# Altium project PA_PCB.PrjPcb
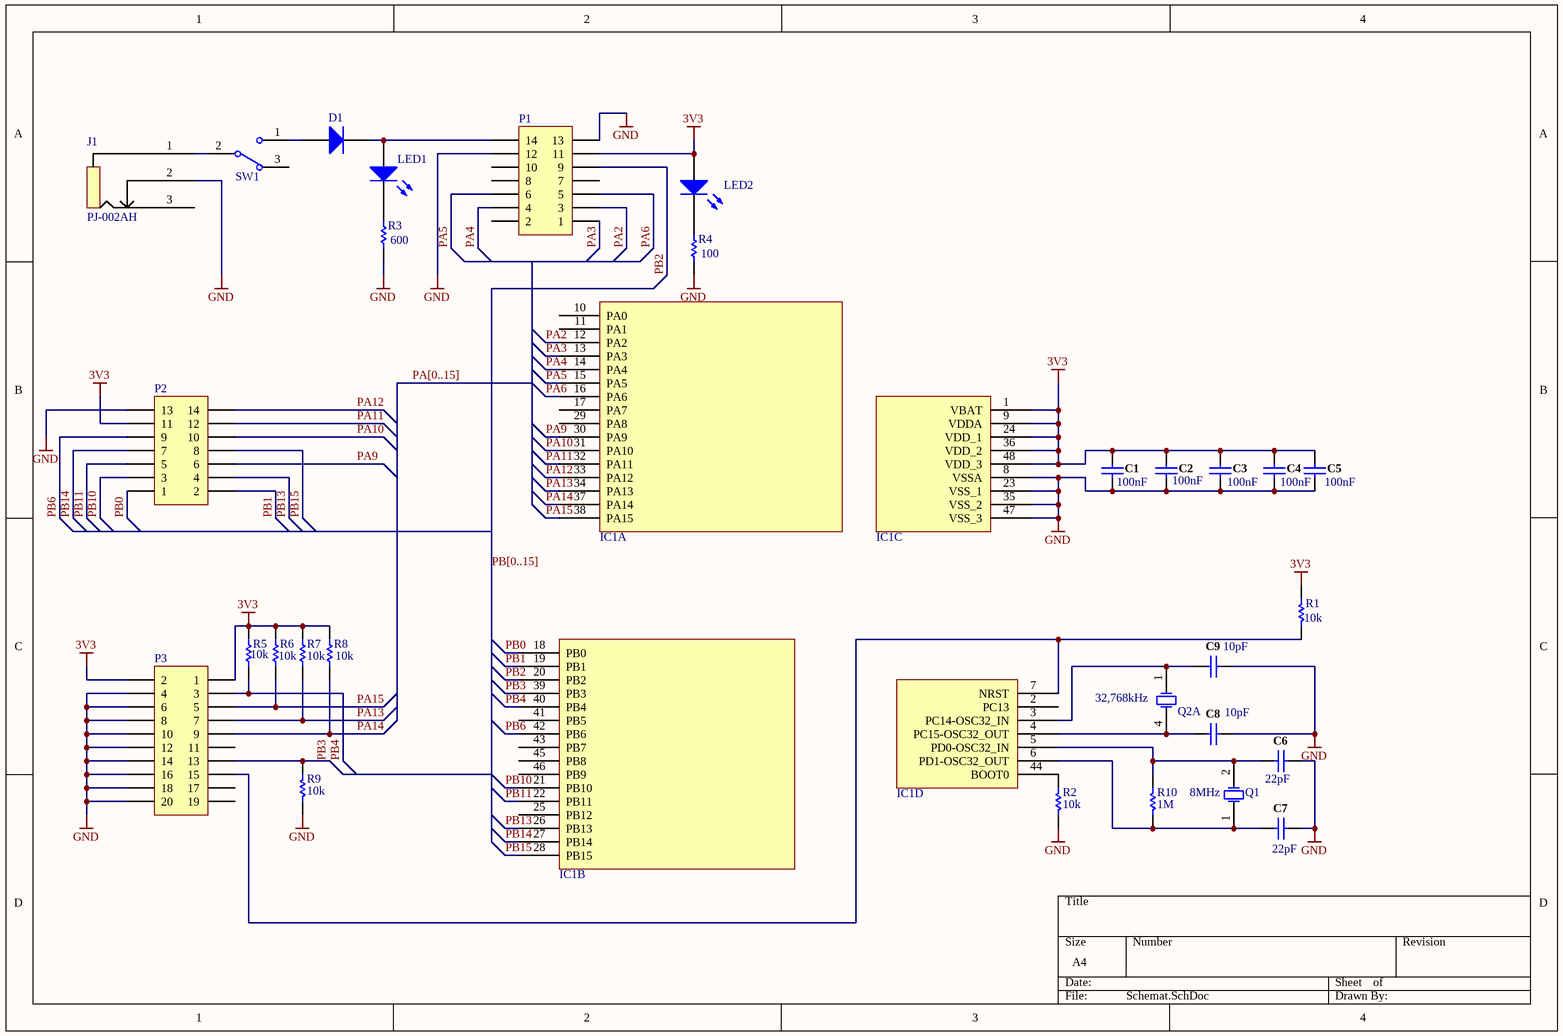
[diagram p0: Schemat.SchDoc]
1 sheet, 30 parts. Net scope: global (net labels, ports and power ports of the same name join across sheets).
Board file: PCB.PcbDoc

## Sheet Schemat.SchDoc
size A4

### Parts
C1  C: 100nF  (hidden comment: Comment)
C2  C: 100nF  (hidden comment: Comment)
C3  C: 100nF  (hidden comment: Comment)
C4  C: 100nF  (hidden comment: Comment)
C5  C: 100nF  (hidden comment: Comment)
C6  C: 22pF  (hidden comment: Comment)
C7  C: 22pF  (hidden comment: Comment)
C8  C: 10pF  (hidden comment: Comment)
C9  C: 10pF  (hidden comment: Comment)
D1  Comment  (value not drawn)
IC1  Comment  (value not drawn)  (parts A,B,C,D of 4)
J1  Supplier Part Number 1: PJ-002AH  (hidden comment: PJ-002AH-SMT)
LED1  Comment  [3.2X1.6X1.1]  (value not drawn)
LED2  Comment  [3.2X1.6X1.1]  (value not drawn)
P1  Comment  [HDR2X7]  (value not drawn)
P2  Comment  [HDR2X7]  (value not drawn)
P3  Comment  [HDR2X10]  (value not drawn)
Q1  f: 8MHz  (hidden comment: Comment)
Q2  f: 32,768kHz  (hidden comment: Comment)  (part A of 2)
R1  R: 10k  (hidden comment: Comment)
R2  R: 10k  (hidden comment: Comment)
R3  R: 600  (hidden comment: Comment)
R4  R: 100  (hidden comment: Comment)
R5  R: 10k  (hidden comment: Comment)
R6  R: 10k  (hidden comment: Comment)
R7  R: 10k  (hidden comment: Comment)
R8  R: 10k  (hidden comment: Comment)
R9  R: 10k  (hidden comment: Comment)
R10  R: 1M  (hidden comment: Comment)
SW1  Comment  (value not drawn)

### Nets
3V3: C1.1 C2.1 C3.1 C4.1 C5.1 IC1.1(VBAT) IC1.9(VDDA) IC1.24(VDD_1) IC1.36(VDD_2) IC1.48(VDD_3) LED2.1(A) P1.11 P2.11 P3.1 P3.2 R1.2 R5.2 R6.2 R7.2 R8.2
GND: C1.2 C2.2 C3.2 C4.2 C5.2 C6.1 C7.1 C8.1 C9.1 IC1.8(VSSA) IC1.23(VSS_1) IC1.35(VSS_2) IC1.47(VSS_3) J1.2 P1.12 P1.13 P2.13 P3.4 P3.6 P3.8 P3.10 P3.12 P3.14 P3.16 P3.18 P3.20 R2.2 R3.1 R4.1 R9.1
PA2: IC1.12(PA2) P1.3
PA3: IC1.13(PA3) P1.1
PA4: IC1.14(PA4) P1.4
PA5: IC1.15(PA5) P1.6
PA6: IC1.16(PA6) P1.5
PA9: IC1.30(PA9) P2.6
PA10: IC1.31(PA10) P2.10
PA11: IC1.32(PA11) P2.12
PA12: IC1.33(PA12) P2.14
PA13: IC1.34(PA13) P3.7 R7.1
PA14: IC1.37(PA14) P3.9 R8.1
PA15: IC1.38(PA15) P3.5 R6.1
PB0: IC1.18(PB0) P2.1
PB1: IC1.19(PB1) P2.2
PB2: IC1.20(PB2) P1.9
PB3: IC1.39(PB3) P3.13 R9.2
PB4: IC1.40(PB4) P3.3 R5.1
PB6: IC1.42(PB6) P2.9
PB10: IC1.21(PB10) P2.3
PB11: IC1.22(PB11) P2.5
PB13: IC1.26(PB13) P2.4
PB14: IC1.27(PB14) P2.7
PB15: IC1.28(PB15) P2.8
NetC6_2: C6.2 IC1.5(PD0-OSC32_IN) Q1.2(X2) R10.2
NetC7_2: C7.2 IC1.6(PD1-OSC32_OUT) Q1.1(X1) R10.1
NetC8_2: C8.2 IC1.4(PC15-OSC32_OUT) Q2.4(X2)
NetC9_2: C9.2 IC1.3(PC14-OSC32_IN) Q2.1(X1)
NetD1_1: D1.1(K) LED1.1(A) P1.14
NetD1_2: D1.2(A) SW1.1
NetIC1_7: IC1.7(NRST) P3.15 R1.1
NetIC1_44: IC1.44(BOOT0) R2.1
NetJ1_1: J1.1 SW1.2
NetLED1_2: LED1.2(K) R3.2
NetLED2_2: LED2.2(K) R4.2

Not connected (* = marked no-connect by the designer): IC1 2(PC13) 10(PA0) 11(PA1) 17(PA7) 25(PB12) 29(PA8) 41(PB5) 43(PB7) 45(PB8) 46(PB9); J1 3; P1 2 7 8 10; P3 11 17 19; SW1 3

### Buses and harness runs
bus PA[0..15]
bus PB[0..15]

### Library data of the parts
C1-C9 = CAP-NP: Capacitor, Non-Polarized
D1 = KESE-D_K1A2-2
IC1 = STM32F103C8T6: Supplier Part Number 1: 1447637; Supplier 1: Farnell; HelpURL: http://dl.btc.pl/kamami_wa/stm32f103_x6_x8_xb.pdf
J1 = PJ-002AH-SMT: DC Power Jack; Supplier 1: NAC Semi; HelpURL: http://www.cui.com/product/resource/pj-102a.pdf
LED1 LED2 = LED2: Typical RED, GREEN, YELLOW, AMBER GaAs LED; Published: 8-Jun-2000; LatestRevisionDate: 17-Jul-2002; LatestRevisionNote: Re-released for DXP Platform.; PackageVersion: Feb-2002; PackageReference: 3.2X1.6X1.1; Publisher: Altium Limited; PackageDescription: SM LED; 2 Flat Leads
P1 P2 = Header 7X2: Header, 7-Pin, Dual row; LatestRevisionDate: 17-Jul-2002; LatestRevisionNote: Re-released for DXP Platform.; Publisher: Altium Limited
P3 = Header 10X2: Header, 10-Pin, Dual row; LatestRevisionDate: 17-Jul-2002; LatestRevisionNote: Re-released for DXP Platform.; Publisher: Altium Limited
Q1 = XTAL_1-2-2
Q2 = ECS-ECX-71-4
R1-R10 = RES-2
SW1 = SW-SPDT-3